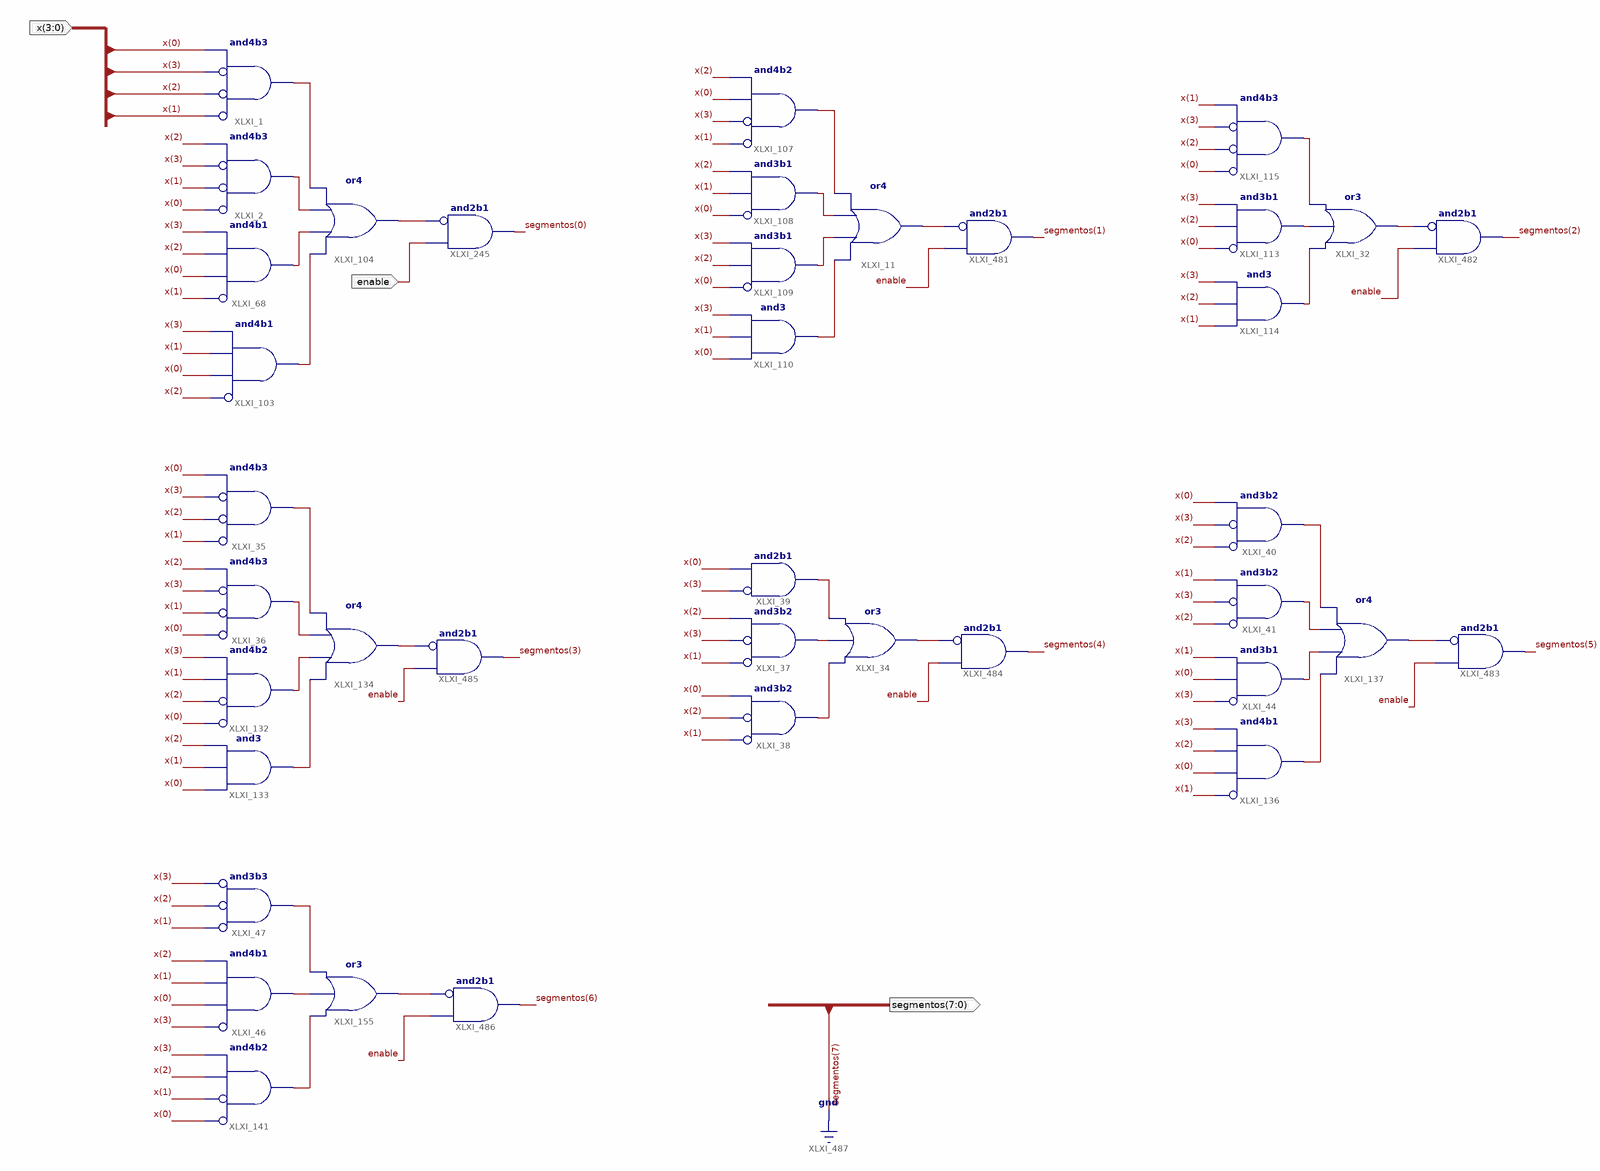
[diagram p0: schematic sheet 1]
// Xilinx ISE schematic Hexadecimal_7Segmentos.sch (spartan6) as structural Verilog: 39 symbols, 3 ports
module Hexadecimal_7Segmentos (
  input  enable,
  input  [3:0] x,
  output [7:0] segmentos
);

  wire XLXN_331, XLXN_332, XLXN_333, XLXN_520, XLXN_523, XLXN_524, XLXN_525, XLXN_537, XLXN_538, XLXN_539,
       XLXN_540, XLXN_555, XLXN_556, XLXN_557, XLXN_569, XLXN_570, XLXN_571, XLXN_572, XLXN_583, XLXN_584,
       XLXN_585, XLXN_586, XLXN_630, XLXN_631, XLXN_632, XLXN_725, XLXN_736, XLXN_739, XLXN_746, XLXN_764,
       XLXN_775, XLXN_1399;

  and XLXI_1 (XLXN_524, ~x[1], ~x[2], ~x[3], x[0]);  // and4b3
  and XLXI_2 (XLXN_523, ~x[0], ~x[1], ~x[3], x[2]);  // and4b3
  and XLXI_68 (XLXN_520, ~x[1], x[0], x[2], x[3]);  // and4b1
  and XLXI_103 (XLXN_525, ~x[2], x[0], x[1], x[3]);  // and4b1
  or XLXI_104 (XLXN_725, XLXN_525, XLXN_520, XLXN_523, XLXN_524);
  and XLXI_36 (XLXN_569, ~x[0], ~x[1], ~x[3], x[2]);  // and4b3
  and XLXI_35 (XLXN_572, ~x[1], ~x[2], ~x[3], x[0]);  // and4b3
  and XLXI_132 (XLXN_570, ~x[0], ~x[2], x[1], x[3]);  // and4b2
  or XLXI_134 (XLXN_746, XLXN_571, XLXN_570, XLXN_569, XLXN_572);
  and XLXI_133 (XLXN_571, x[0], x[1], x[2]);
  and XLXI_47 (XLXN_631, ~x[1], ~x[2], ~x[3]);  // and3b3
  and XLXI_46 (XLXN_630, ~x[3], x[0], x[1], x[2]);  // and4b1
  and XLXI_141 (XLXN_632, ~x[0], ~x[1], x[2], x[3]);  // and4b2
  or XLXI_155 (XLXN_1399, XLXN_632, XLXN_630, XLXN_631);
  or XLXI_11 (XLXN_736, XLXN_539, XLXN_538, XLXN_537, XLXN_540);
  and XLXI_110 (XLXN_539, x[0], x[1], x[3]);
  and XLXI_109 (XLXN_538, ~x[0], x[2], x[3]);  // and3b1
  and XLXI_108 (XLXN_537, ~x[0], x[1], x[2]);  // and3b1
  and XLXI_107 (XLXN_540, ~x[1], ~x[3], x[0], x[2]);  // and4b2
  and XLXI_38 (XLXN_333, ~x[1], ~x[2], x[0]);  // and3b2
  or XLXI_34 (XLXN_764, XLXN_333, XLXN_331, XLXN_332);
  and XLXI_37 (XLXN_331, ~x[1], ~x[3], x[2]);  // and3b2
  and XLXI_39 (XLXN_332, ~x[3], x[0]);  // and2b1
  and XLXI_136 (XLXN_586, ~x[1], x[0], x[2], x[3]);  // and4b1
  or XLXI_137 (XLXN_775, XLXN_586, XLXN_584, XLXN_583, XLXN_585);
  and XLXI_40 (XLXN_585, ~x[2], ~x[3], x[0]);  // and3b2
  and XLXI_41 (XLXN_583, ~x[2], ~x[3], x[1]);  // and3b2
  and XLXI_44 (XLXN_584, ~x[3], x[0], x[1]);  // and3b1
  or XLXI_32 (XLXN_739, XLXN_557, XLXN_555, XLXN_556);
  and XLXI_114 (XLXN_557, x[1], x[2], x[3]);
  and XLXI_115 (XLXN_556, ~x[0], ~x[2], ~x[3], x[1]);  // and4b3
  and XLXI_113 (XLXN_555, ~x[0], x[2], x[3]);  // and3b1
  and XLXI_245 (segmentos[0], ~XLXN_725, enable);  // and2b1
  and XLXI_481 (segmentos[1], ~XLXN_736, enable);  // and2b1
  and XLXI_482 (segmentos[2], ~XLXN_739, enable);  // and2b1
  and XLXI_483 (segmentos[5], ~XLXN_775, enable);  // and2b1
  and XLXI_484 (segmentos[4], ~XLXN_764, enable);  // and2b1
  and XLXI_485 (segmentos[3], ~XLXN_746, enable);  // and2b1
  and XLXI_486 (segmentos[6], ~XLXN_1399, enable);  // and2b1

  assign segmentos[7] = 1'b0;
endmodule
